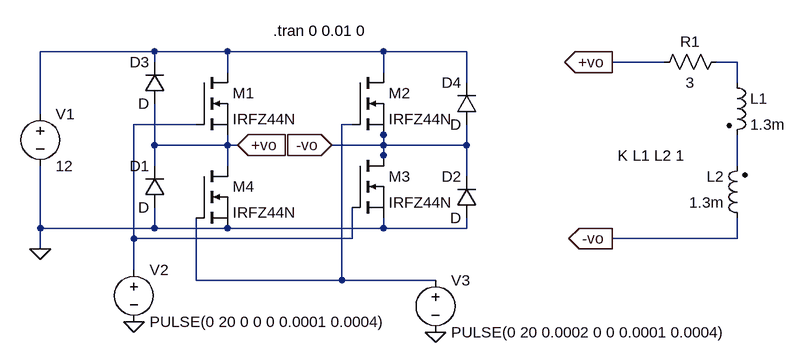
[diagram p0: schematic Draft5.asc]
Draft5.asc, the LTspice schematic file:
Version 4
SHEET 1 1160 680
WIRE 64 80 -112 80
WIRE 176 80 64 80
WIRE 416 80 176 80
WIRE 544 80 416 80
WIRE 64 96 64 80
WIRE 848 96 768 96
WIRE 960 96 928 96
WIRE 176 112 176 80
WIRE 416 112 416 80
WIRE 544 128 544 80
WIRE 960 128 960 96
WIRE -112 176 -112 80
WIRE 128 192 32 192
WIRE 368 192 352 192
WIRE 416 208 416 192
WIRE 64 224 64 160
WIRE 176 224 176 208
WIRE 176 224 64 224
WIRE 192 224 176 224
WIRE 416 224 416 208
WIRE 416 224 336 224
WIRE 544 224 544 192
WIRE 544 224 416 224
WIRE 416 240 416 224
WIRE 64 256 64 224
WIRE 176 256 176 224
WIRE 416 256 416 240
WIRE 960 256 960 208
WIRE 544 272 544 224
WIRE -112 352 -112 256
WIRE 64 352 64 320
WIRE 64 352 -112 352
WIRE 176 352 64 352
WIRE 416 352 416 336
WIRE 416 352 176 352
WIRE 544 352 544 336
WIRE 544 352 416 352
WIRE 32 368 32 192
WIRE 368 368 368 320
WIRE 368 368 32 368
WIRE 960 368 960 336
WIRE 960 368 768 368
WIRE -112 384 -112 352
WIRE 32 416 32 368
WIRE 128 432 128 336
WIRE 352 432 352 192
WIRE 352 432 128 432
WIRE 496 432 352 432
FLAG 32 496 0
FLAG 496 512 0
FLAG -112 384 0
FLAG 768 96 +vo
IOPIN 768 96 Out
FLAG 768 368 -vo
IOPIN 768 368 Out
FLAG 336 224 -vo
IOPIN 336 224 In
FLAG 192 224 +vo
IOPIN 192 224 In
SYMBOL diode 80 320 R180
WINDOW 0 24 64 Left 2
WINDOW 3 24 0 Left 2
SYMATTR InstName D1
SYMBOL diode 560 336 R180
WINDOW 0 24 64 Left 2
WINDOW 3 24 0 Left 2
SYMATTR InstName D2
SYMBOL diode 80 160 R180
WINDOW 0 24 64 Left 2
WINDOW 3 24 0 Left 2
SYMATTR InstName D3
SYMBOL diode 560 192 R180
WINDOW 0 24 64 Left 2
WINDOW 3 24 0 Left 2
SYMATTR InstName D4
SYMBOL voltage -112 160 R0
WINDOW 123 0 0 Left 0
WINDOW 39 0 0 Left 0
SYMATTR InstName V1
SYMATTR Value 12
SYMBOL voltage 32 400 R0
WINDOW 123 0 0 Left 0
WINDOW 39 0 0 Left 0
SYMATTR InstName V2
SYMATTR Value PULSE(0 20 0 0 0 0.0001 0.0004)
SYMBOL voltage 496 416 R0
WINDOW 123 0 0 Left 0
WINDOW 39 0 0 Left 0
SYMATTR InstName V3
SYMATTR Value PULSE(0 20 0.0002 0 0 0.0001 0.0004)
SYMBOL nmos 128 112 R0
SYMATTR InstName M1
SYMATTR Value IRFZ44N
SYMBOL nmos 368 112 R0
SYMATTR InstName M2
SYMATTR Value IRFZ44N
SYMBOL nmos 368 240 R0
SYMATTR InstName M3
SYMATTR Value IRFZ44N
SYMBOL nmos 128 256 R0
SYMATTR InstName M4
SYMATTR Value IRFZ44N
SYMBOL res 944 80 R90
WINDOW 0 0 56 VBottom 2
WINDOW 3 32 56 VTop 2
SYMATTR InstName R1
SYMATTR Value 3
SYMBOL ind2 944 112 R0
SYMATTR InstName L1
SYMATTR Value 1.3m
SYMATTR Type ind
SYMBOL ind2 976 352 R180
WINDOW 0 36 80 Left 2
WINDOW 3 36 40 Left 2
SYMATTR InstName L2
SYMATTR Value 1.3m
SYMATTR Type ind
TEXT 246 48 Left 2 !.tran 0 0.01 0
TEXT 776 240 Left 2 !K L1 L2 1

The netlist it stands for:
* Draft5.asc
D1 0 +vo D
D2 0 -vo D
D3 +vo N001 D
D4 -vo N001 D
V1 N001 0 12
V2 N003 0 PULSE(0 20 0 0 0 0.0001 0.0004)
V3 N004 0 PULSE(0 20 0.0002 0 0 0.0001 0.0004)
M1 N001 N003 +vo +vo IRFZ44N
M2 N001 N004 -vo -vo IRFZ44N
M3 -vo N003 0 0 IRFZ44N
M4 +vo N004 0 0 IRFZ44N
R1 N002 +vo 3
L1 N002 N005 1.3m
L2 -vo N005 1.3m
.model D D
.lib standard.dio
.model NMOS NMOS
.model PMOS PMOS
.lib standard.mos
.tran 0 0.01 0
K L1 L2 1
.backanno
.end